# EasyEDA Pro project DRV电机驱动板_2024-10-17.epro

# Schematic DRV电机驱动
Create Date: 2023-05-12; Page Name: P1; Project Name: DRV电机驱动（最终版）; Schematic Name: DRV电机驱动; Update Date: 2023-05-27; Company: 嘉立创EDA; Page Size: A4; Version: V1.0
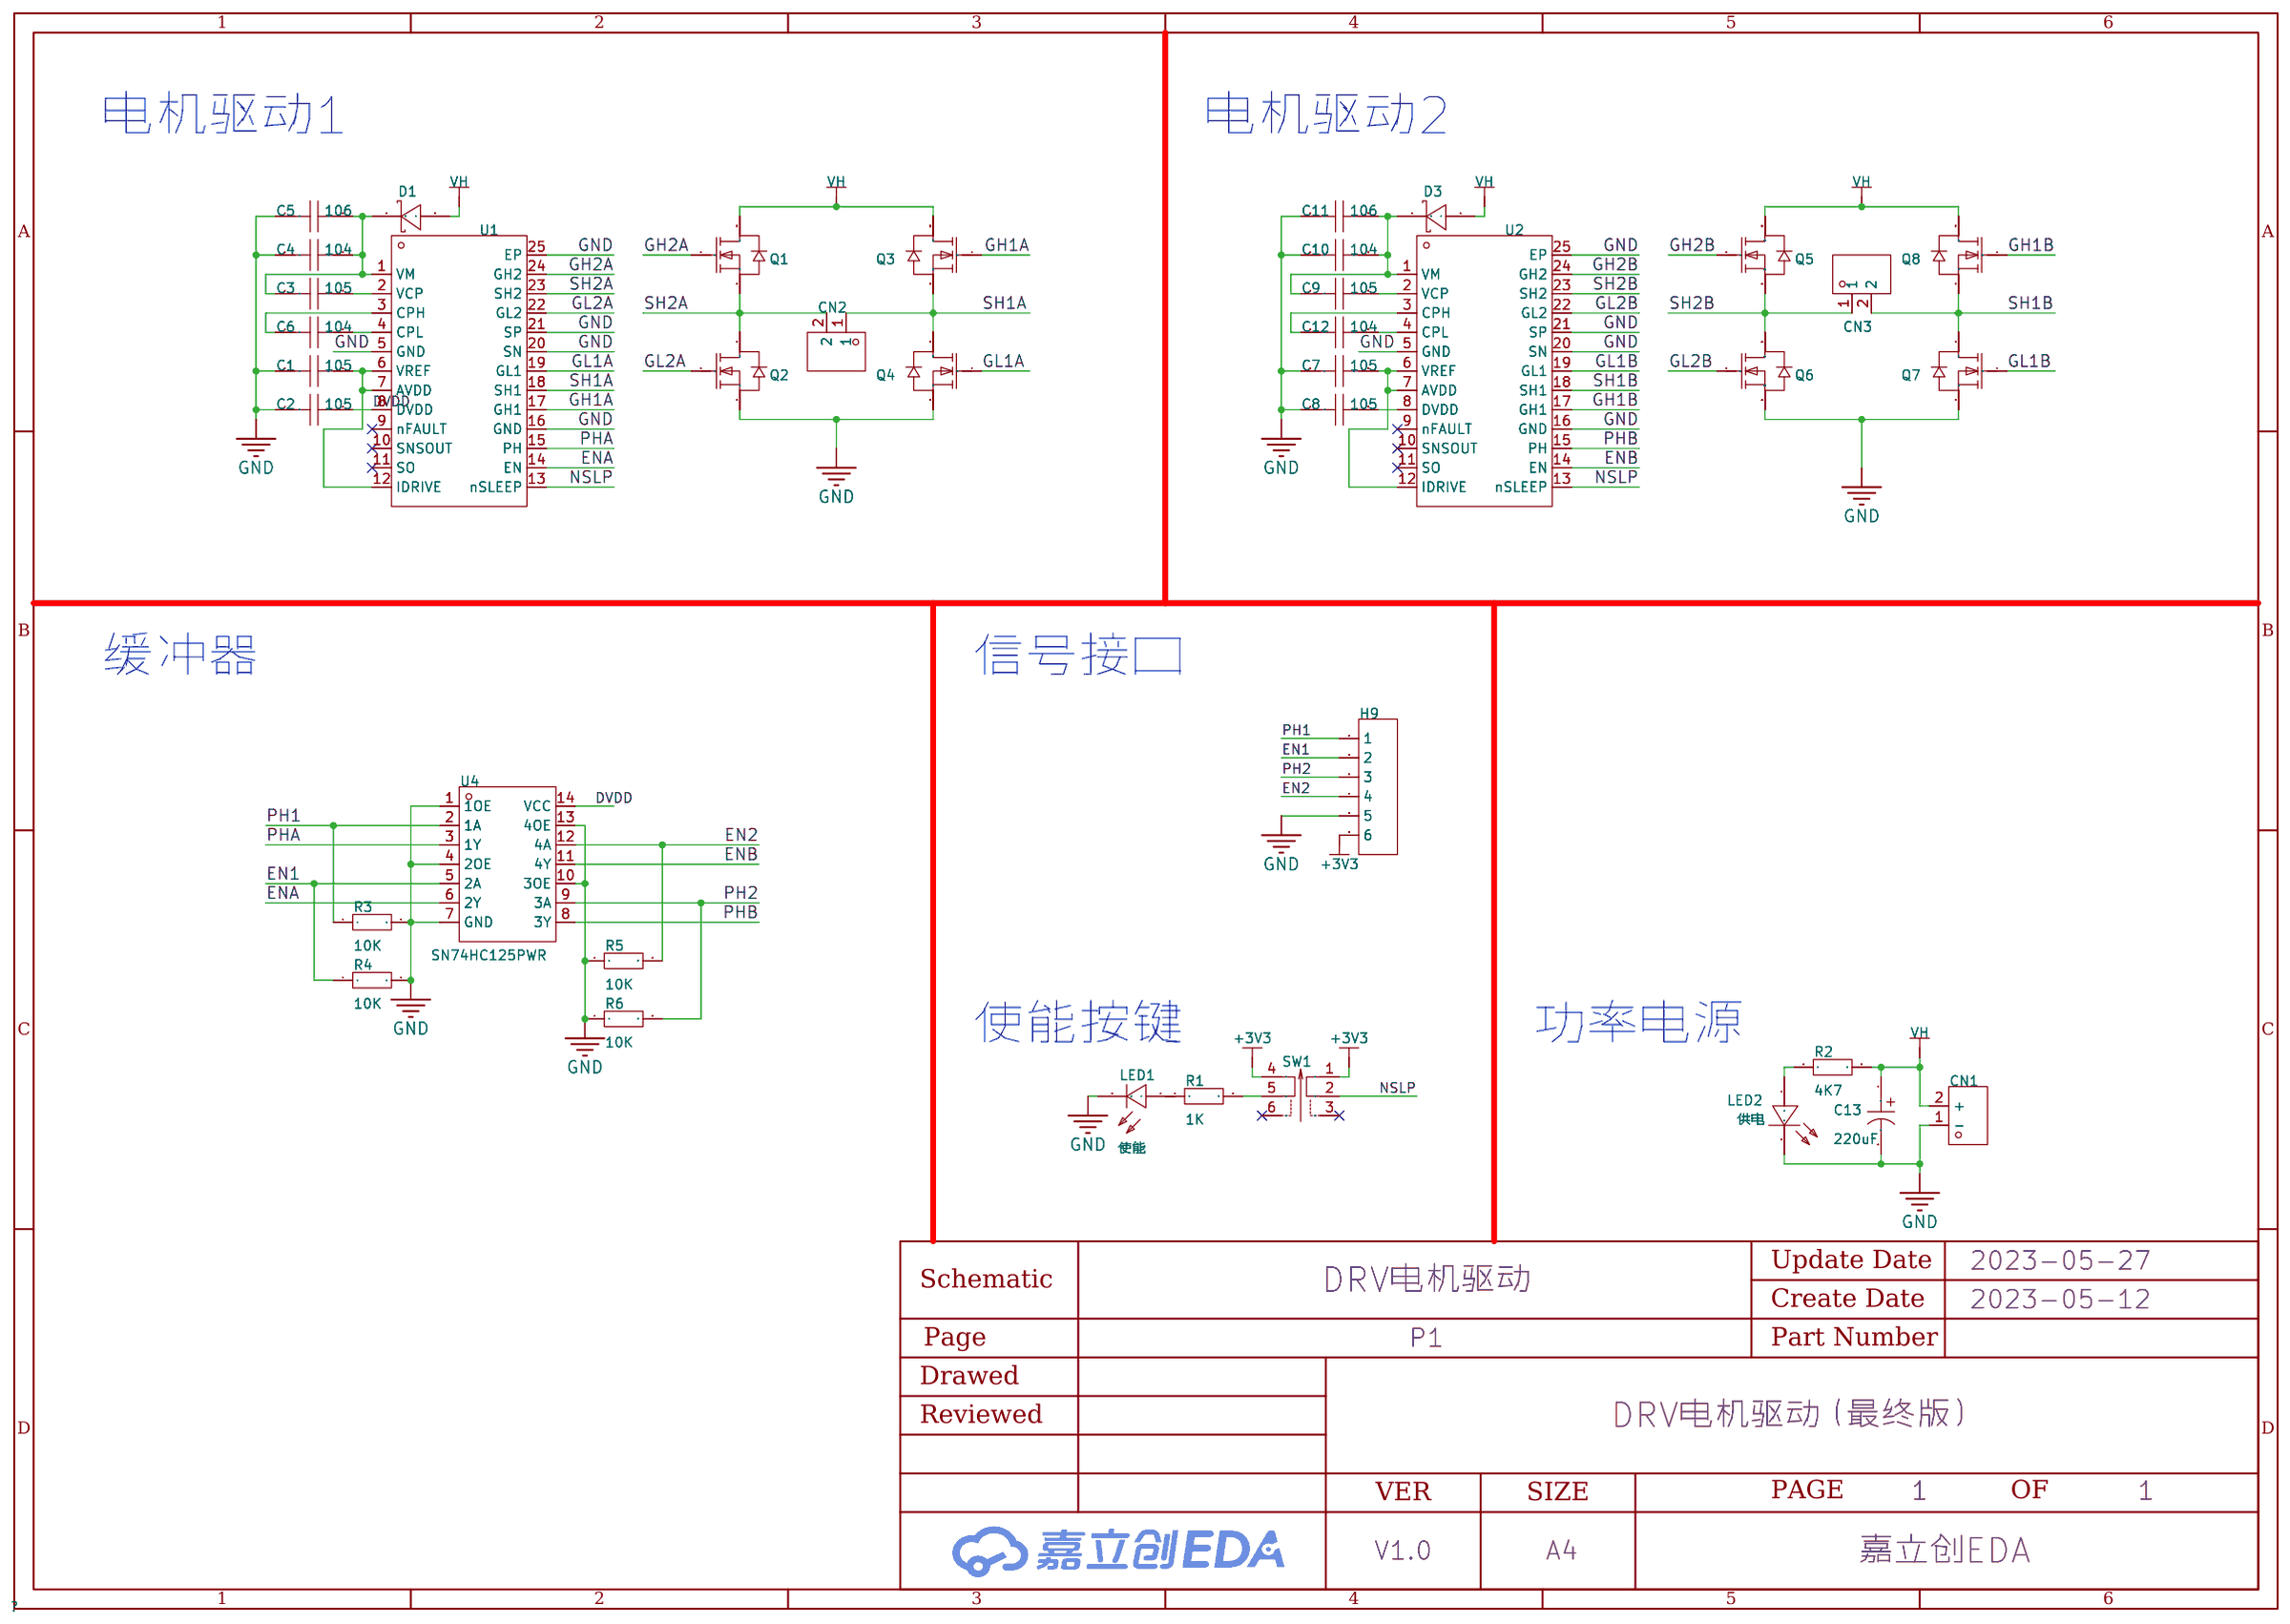
[diagram p0: schematic sheet]

## Parts
C1  105  [C0603]
C2  105  [C0603]
C3  105  [C0603]
C4  104  [C0603]
C5  106  [C0603]
C6  104  [C0603]
C7  105  [C0603]
C8  105  [C0603]
C9  105  [C0603]
C10  104  [C0603]
C11  106  [C0603]
C12  104  [C0603]
C13  220uF  [CAP-TH_BD8.0-P3.50-D0.6-FD]
CN1  -  [CONN-TH_XT30UPB-M]
CN2  KF301-5.0-2P  [CONN-TH_P5.00_KF301-5.0-2P]
CN3  KF301-5.0-2P  [CONN-TH_P5.00_KF301-5.0-2P]
D1  1N5819WS  [SOD-323_L1.8-W1.3-LS2.5-RD]
D3  1N5819WS  [SOD-323_L1.8-W1.3-LS2.5-RD]
H9  -  [HDR-TH_6P-P2.54-V-M-1]
LED1  使能  [LED0603-R-RD]
LED2  供电  [LED0603-R-RD]
Q1  CSD17570Q5B  [PG-TSON-8_L5.0-W6.0-P1.27-BL-EP_BSC021N08NS5]
Q2  CSD17570Q5B  [PG-TSON-8_L5.0-W6.0-P1.27-BL-EP_BSC021N08NS5]
Q3  CSD17570Q5B  [PG-TSON-8_L5.0-W6.0-P1.27-BL-EP_BSC021N08NS5]
Q4  CSD17570Q5B  [PG-TSON-8_L5.0-W6.0-P1.27-BL-EP_BSC021N08NS5]
Q5  CSD17570Q5B  [PG-TSON-8_L5.0-W6.0-P1.27-BL-EP_BSC021N08NS5]
Q6  CSD17570Q5B  [PG-TSON-8_L5.0-W6.0-P1.27-BL-EP_BSC021N08NS5]
Q7  CSD17570Q5B  [PG-TSON-8_L5.0-W6.0-P1.27-BL-EP_BSC021N08NS5]
Q8  CSD17570Q5B  [PG-TSON-8_L5.0-W6.0-P1.27-BL-EP_BSC021N08NS5]
R1  1K  [R0603]
R2  4K7  [R0603]
R3  10K  [R0603]
R4  10K  [R0603]
R5  10K  [R0603]
R6  10K  [R0603]
SW1  使能开关  [SW-TH_6P-L5.8-W5.8-P2.00-LS4.5-BL]
U1  DRV8701ERGER  [VQFN-24_L4.0-W4.0-P0.50-BL-EP2.8]
U2  DRV8701ERGER  [VQFN-24_L4.0-W4.0-P0.50-BL-EP2.8]
U4  SN74HC125PWR  [TSSOP-14_L5.0-W4.4-P0.65-LS6.4-TL]

## Library data of the parts
C1-C12 = CAP_0603: 容值:100nF;精度:±10%;额定电压:50V;温度系数:X7R;; Supplier Footprint: 0603
C13 = 250ARHA221M08A2: 类型:-;容值:220uF;精度:±20%;额定电压:25V;电容体直径:-;电容体长度:-;脚间距:-;纹波电流:-;等效串联电阻:-;工作寿命:-;工作温度:-;; LCSC Part Name: 220uF ±20% 25V; Supplier Part: C2681188; Manufacturer: APAQ(钰邦); Supplier Footprint: Radial,8x11.5mm; JLCPCB Part Class: 扩展库; Datasheet: https://atta.szlcsc.com/upload/public/pdf/source/20180420/C176310_E0097FD36002676809AE81630543C9E8.pdf; Supplier: LCSC; Tolerance: ±20%; Rated Voltage: 25V
CN1 = XT30UPB-M: Supplier Part: C428721; Manufacturer: AMASS(艾迈斯); JLCPCB Part Class: 扩展库; Datasheet: https://atta.szlcsc.com/upload/public/pdf/source/20190916/C428721_B0ECB8C5937139CEFE8736D2D3175B0E.pdf; Supplier: LCSC
CN2 CN3 = KF301-5.0-2P: 间距:5mm;排数:1;每排PIN数:2;安装方式:直针;额定电流:17A;额定电压:250V;线规 - AWG:14~22;线规 - mm?:1.5;工作温度范围:-30~+120;颜色:蓝色;; LCSC Part Name: 5mm 排数:1 每排P数:2 直针 可拼接 铜 环保; Supplier Part: C474881; Manufacturer: KEFA(科发); Supplier Footprint: P=5mm; JLCPCB Part Class: 扩展库; Datasheet: https://atta.szlcsc.com/upload/public/pdf/source/20200115/C474881_883EFE2003339C40FD1BEEEFC9A18423.pdf; Supplier: LCSC; Pitch: 5mm; Number of Rows: 1; Number of PINs Per Row: 2; Mounting Style: 直针; Current Rating (Max): 17A; Voltage Rating (Max): 250V; Wire Gauge - AWG: 14~22; Wire Gauge - mm?: 1.5; Operating Temperature Range: -30~+120; Color: 蓝色
D1 D3 = 1N5819WS_C440261: 直流反向耐压(Vr):40V;平均整流电流(Io):1A;正向压降(Vf):900mV@3A;; LCSC Part Name: 40V 1A 900mV@3A; Supplier Part: C440261; Manufacturer: PJSEMI(平晶微); Supplier Footprint: SOD-323; JLCPCB Part Class: 扩展库; Datasheet: https://atta.szlcsc.com/upload/public/pdf/source/20210224/C440261_8032C480D816C9C5CCE6FA0D0539A89A.pdf; Supplier: LCSC; Reverse Voltage (Vr): 40V; Average Rectified Current (Io): 1A; Forward Voltage (Vf@If): 900mV@3A
H9 = HDR-M_2.54_1x6P: Supplier Part: C37208; Supplier Footprint: 插件
LED1 = 19-217/G7C-AN1P2/3T: 照明颜色:普绿/黄绿;色温 - CCT（K）:-;主波长/色坐标:569.5~577.5nm;; LCSC Part Name: 0603 普绿/黄绿; Supplier Part: C72042; Manufacturer: EVERLIGHT(台湾亿光); Supplier Footprint: 0603; JLCPCB Part Class: 扩展库; Datasheet: https://atta.szlcsc.com/upload/public/pdf/source/20160507/1462613613739.pdf; Supplier: LCSC; Mounting Type: 表面贴装; Illumination Color: 普绿/黄绿; Luminous Intensity (IF=20mA): 28.5~72mcd; Dominant Wavelength / Coordinate rank: 569.5~577.5nm
LED2 = TLMS1000-GS08: 发光颜色:红灯;; LCSC Part Name: 红色 0603; Supplier Part: C241893; Manufacturer: VISHAY(威世); Supplier Footprint: 0603; JLCPCB Part Class: 扩展库; Datasheet: https://atta.szlcsc.com/upload/public/pdf/source/20180719/C241893_4BC7C846B3C52AB2D39E337E84999DF0.pdf; Supplier: LCSC; Emitted Color: 红灯
Q1-Q8 = CSD17570Q5B: 类型:-;漏源电压(Vdss):-;连续漏极电流(Id):-;功率(Pd):-;导通电阻(RDS(on)@Vgs,Id):-;阈值电压(Vgs(th)@Id):-;栅极电荷(Qg@Vgs):-;输入电容(Ciss@Vds):-;反向传输电容(Crss@Vds):-;; Supplier Part: C529279; Manufacturer: TI(德州仪器); Supplier Footprint: SON-8; JLCPCB Part Class: 扩展库; Datasheet: https://atta.szlcsc.com/upload/public/pdf/source/20200515/C529279_3264872A3F90DE278B9C19CF73F09D82.pdf; Supplier: LCSC
R1-R6 = Res_0603: Supplier Footprint: 0603
SW1 = PB22E60L: 触点电流:500mA;额定电压 (AC):-;额定电压 (DC):50V;绝缘电阻:100MΩ;电路结构:双刀双掷;安装方式:直插;自锁/无锁:-;按键形状:方形柱塞;按键/盖帽颜色:白色;带灯:-;引脚样式:PC引脚;作用力:180gf@±50gf;防护等级:-;工作温度:-40~+85;机械寿命:30000;; LCSC Part Name: 自锁开关; Supplier Part: C2987421; Manufacturer: CIKI(皓富); Supplier Footprint: 插件; JLCPCB Part Class: 扩展库; Datasheet: https://atta.szlcsc.com/upload/public/pdf/source/20220408/7804C2A84B830DBCF70465BF0AEFEFAC.pdf; Supplier: LCSC; Contact Current: 500mA; Voltage Rating (DC): 50V; Insulation Resistance: 100MΩ; Circuit: 双刀双掷; Mounting Style: 直插; Actuator Style: 方形柱塞; Actuator/Cap Color: 白色; Pin Style: PC引脚; Operating Force: 180gf@±50gf; Operating Temperature: -40~+85; Mechanical Life: 30000
U1 U2 = DRV8701ERGER: DRV8701 DRV8701 H 桥栅极驱动器; Supplier Part: C90964; Manufacturer: TI(德州仪器); Supplier Footprint: VQFN-24; JLCPCB Part Class: 扩展库; Datasheet: https://atta.szlcsc.com/upload/public/pdf/source/20190902/C90964_2DCC43C1A4AE58E3ED96296E8C78517C.pdf; Supplier: LCSC
U4 = SN74HC125PWRG4: 类型:缓冲器，非反相;电源电压:2V~6V;输入类型:-;输出类型:三态;低电平输出电流(IOL):7.8mA;高电平输出电流(IOH):7.8mA;工作温度:-40℃~+85℃;; Supplier Part: C2676184; Manufacturer: TI(德州仪器); Supplier Footprint: TSSOP-14; JLCPCB Part Class: Extended Part; Supplier: LCSC; Type: 缓冲器，非反相; Supply Voltage: 2V~6V; output type: 三态; Current-OutputLow: 7.8mA; Current-OutputHigh: 7.8mA; Operating temperature: -40℃~+85℃

## Nets
+3V3: H9.6 SW1.1 SW1.4
DVDD: C2.2 U1.8(DVDD) U4.14(VCC)
GND: C1.1 C2.1 C4.1 C5.1 C7.1 C8.1 C10.1 C11.1 C13.2 CN1.1(-) H9.5 LED1.2(C) LED2.2(K) Q2.1(S) Q2.2(S) Q2.3(S) Q4.1(S) Q4.2(S) Q4.3(S) Q6.1(S) Q6.2(S) Q6.3(S) Q7.1(S) Q7.2(S) Q7.3(S) R3.2 R4.2 R5.1 R6.1 U1.5(GND) U1.16(GND) U1.20(SN) U1.21(SP) U1.25(EP) U2.5(GND) U2.16(GND) U2.20(SN) U2.21(SP) U2.25(EP) U4.1(1OE) U4.4(2OE) U4.7(GND) U4.10(3OE) U4.13(4OE)
EN1: H9.2 R4.1 U4.5(2A)
EN2: H9.4 R5.2 U4.12(4A)
ENA: U1.14(EN) U4.6(2Y)
ENB: U2.14(EN) U4.11(4Y)
GH1A: Q3.4(G) U1.17(GH1)
GH1B: Q8.4(G) U2.17(GH1)
GH2A: Q1.4(G) U1.24(GH2)
GH2B: Q5.4(G) U2.24(GH2)
GL1A: Q4.4(G) U1.19(GL1)
GL1B: Q7.4(G) U2.19(GL1)
GL2A: Q2.4(G) U1.22(GL2)
GL2B: Q6.4(G) U2.22(GL2)
NSLP: SW1.2 U1.13(nSLEEP) U2.13(nSLEEP)
PH1: H9.1 R3.1 U4.2(1A)
PH2: H9.3 R6.2 U4.9(3A)
PHA: U1.15(PH) U4.3(1Y)
PHB: U2.15(PH) U4.8(3Y)
SH1A: CN2.1 Q3.1(S) Q3.2(S) Q3.3(S) Q4.5(D) Q4.6(D) Q4.7(D) Q4.8(D) U1.18(SH1)
SH1B: CN3.2 Q7.5(D) Q7.6(D) Q7.7(D) Q7.8(D) Q8.1(S) Q8.2(S) Q8.3(S) U2.18(SH1)
SH2A: CN2.2 Q1.1(S) Q1.2(S) Q1.3(S) Q2.5(D) Q2.6(D) Q2.7(D) Q2.8(D) U1.23(SH2)
SH2B: CN3.1 Q5.1(S) Q5.2(S) Q5.3(S) Q6.5(D) Q6.6(D) Q6.7(D) Q6.8(D) U2.23(SH2)
VH: C13.1 CN1.2(+) D1.2(A) D3.2(A) Q1.5(D) Q1.6(D) Q1.7(D) Q1.8(D) Q3.5(D) Q3.6(D) Q3.7(D) Q3.8(D) Q5.5(D) Q5.6(D) Q5.7(D) Q5.8(D) Q8.5(D) Q8.6(D) Q8.7(D) Q8.8(D) R2.2
$C1_2: C1.2 U1.6(VREF) U1.7(AVDD) U1.12(IDRIVE)
$C3_1: C3.1 C4.2 C5.2 D1.1(C) U1.1(VM)
$C3_2: C3.2 U1.2(VCP)
$C6_1: C6.1 U1.3(CPH)
$C6_2: C6.2 U1.4(CPL)
$C7_2: C7.2 U2.6(VREF) U2.7(AVDD) U2.12(IDRIVE)
$C8_2: C8.2 U2.8(DVDD)
$C9_1: C9.1 C10.2 C11.2 D3.1(C) U2.1(VM)
$C9_2: C9.2 U2.2(VCP)
$C12_1: C12.1 U2.3(CPH)
$C12_2: C12.2 U2.4(CPL)
$LED1_1: LED1.1(A) R1.1
$LED2_1: LED2.1(A) R2.1
$R1_2: R1.2 SW1.5

Not connected (* = marked no-connect by the designer): SW1 3* 6*; U1 9(nFAULT)* 10(SNSOUT)* 11(SO)*; U2 9(nFAULT)* 10(SNSOUT)* 11(SO)*

## Notes on the sheet
- 电机驱动1
- 电机驱动2
- 缓冲器
- 信号接口
- 使能按键
- 功率电源

# Board PCB2
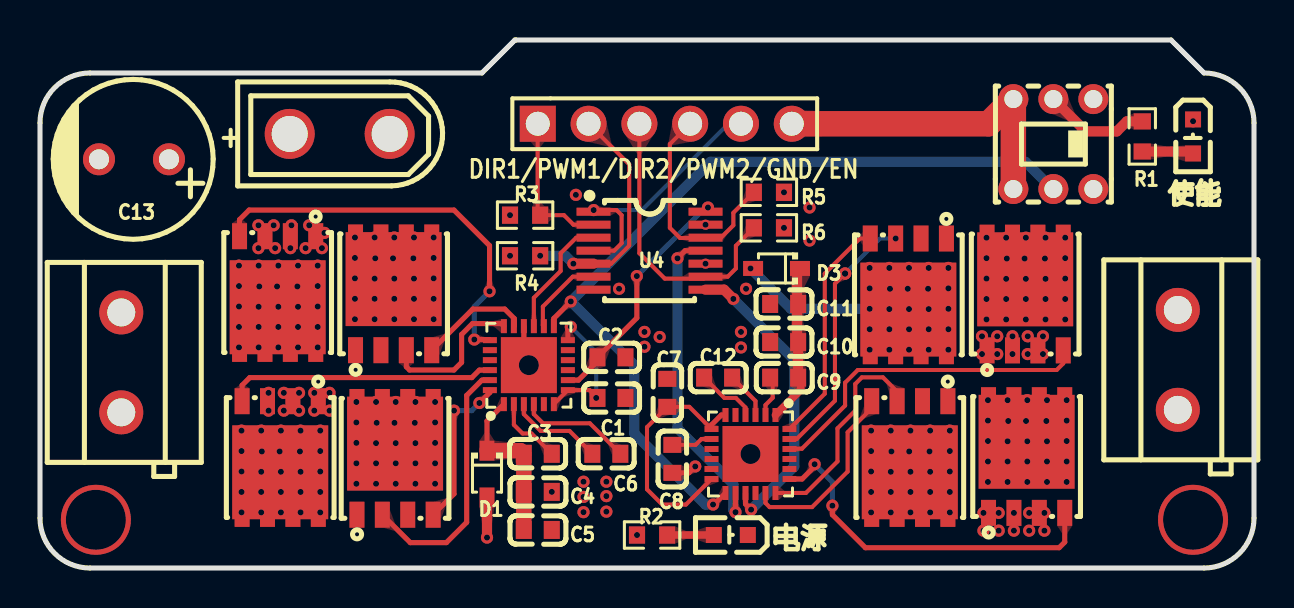
[diagram p1: board, top side]
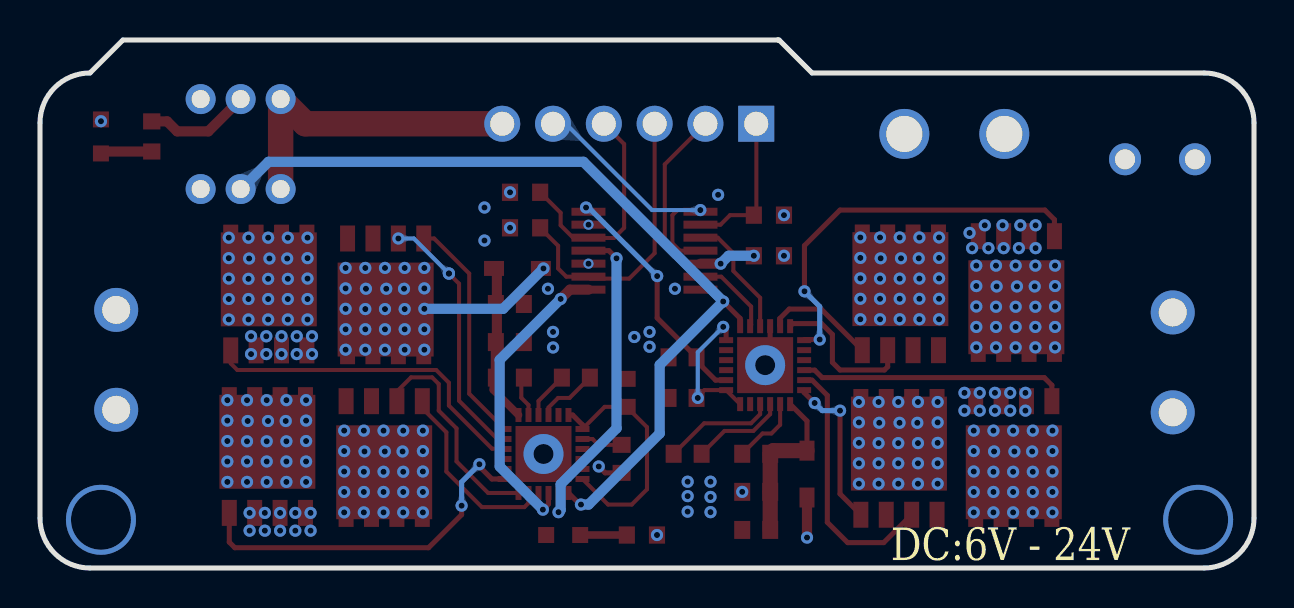
[diagram p2: board, bottom side, seen from below]

Outline 60.71 x 26.42 mm; copper layers: Top Layer, Bottom Layer. Coordinates in mm from the lower left corner of the outline.
Outline path: 0,22.27 0,2.5 arc(0.73,0.73) 2.5,0 58.21,0 arc(59.97,0.73) 60.71,2.5 60.71,22.27 arc(59.97,24.03) 58.21,24.77 56.55,26.42 23.75,26.42 22.1,24.77 2.5,24.77 arc(0.73,24.03) 0,22.27
Stack: Top Layer 0.035mm / Dielectric1 1.51mm FR4 er 4.5 / Bottom Layer 0.035mm

## Design rules (mm)
spacing copperThickness1oz (default): track to track 0.102, other pairs 0.152 to 0.3
spacing copperThickness2oz: track to track 0.203, other pairs 0.152 to 0.3
track width copperThickness1oz (default): min 0.127, default 0.254, max 2.54
track width copperThickness2oz: min 0.203, default 0.254, max 2.54
differential pair differentialPair (default): width min 0.127, default 0.254, max 2.54; gap min 0.152, default 0.152
via viaSize (default): diameter min 0.5, default 0.61, max 10; hole min 0.3, default 0.305, max 6.3

## Placement (name value [footprint] x y rotation side)
C1  105  [C0603]  28.58 8.51 180 top
C2  105  [C0603]  28.58 10.54 180 top
C3  105  [C0603]  24.89 5.72 0 top
C4  104  [C0603]  24.89 3.81 180 top
C5  106  [C0603]  24.89 1.91 180 top
C6  104  [C0603]  28.32 5.72 0 top
C7  105  [C0603]  31.37 8.76 270 top
C8  105  [C0603]  31.62 5.46 90 top
C9  105  [C0603]  37.21 9.53 180 top
C10  104  [C0603]  37.21 11.3 0 top
C11  106  [C0603]  37.21 13.21 0 top
C12  104  [C0603]  33.91 9.53 180 top
C13  220uF  [CAP-TH_BD8.0-P3.50-D0.6-FD]  4.7 20.45 180 top
CN1  -  [CONN-TH_XT30UPB-M]  14.99 21.72 180 top
CN2  KF301-5.0-2P  [CONN-TH_P5.00_KF301-5.0-2P]  4.06 10.29 270 top
CN3  KF301-5.0-2P  [CONN-TH_P5.00_KF301-5.0-2P]  56.9 10.41 270 top
D1  1N5819WS  [SOD-323_L1.8-W1.3-LS2.5-RD]  22.35 4.7 270 top
D3  1N5819WS  [SOD-323_L1.8-W1.3-LS2.5-RD]  36.83 14.99 180 top
H9  -  [HDR-TH_6P-P2.54-V-M-1]  31.24 22.22 0 top
LED1  使能  [LED0603-R-RD]  57.66 21.59 270 top
LED2  供电  [LED0603-R-RD]  34.54 1.65 180 top
Q1  CSD17570Q5B  [PG-TSON-8_L5.0-W6.0-P1.27-BL-EP_BSC021N08NS5]  17.75 5.49 0 top
Q2  CSD17570Q5B  [PG-TSON-8_L5.0-W6.0-P1.27-BL-EP_BSC021N08NS5]  12.01 5.53 180 top
Q3  CSD17570Q5B  [PG-TSON-8_L5.0-W6.0-P1.27-BL-EP_BSC021N08NS5]  17.68 13.72 0 top
Q4  CSD17570Q5B  [PG-TSON-8_L5.0-W6.0-P1.27-BL-EP_BSC021N08NS5]  11.88 13.78 180 top
Q5  CSD17570Q5B  [PG-TSON-8_L5.0-W6.0-P1.27-BL-EP_BSC021N08NS5]  43.42 13.67 180 top
Q6  CSD17570Q5B  [PG-TSON-8_L5.0-W6.0-P1.27-BL-EP_BSC021N08NS5]  49.26 13.71 0 top
Q7  CSD17570Q5B  [PG-TSON-8_L5.0-W6.0-P1.27-BL-EP_BSC021N08NS5]  49.34 5.58 0 top
Q8  CSD17570Q5B  [PG-TSON-8_L5.0-W6.0-P1.27-BL-EP_BSC021N08NS5]  43.49 5.53 180 top
R1  1K  [R0603]  55.12 21.59 90 top
R2  4K7  [R0603]  30.61 1.65 180 top
R3  10K  [R0603]  24.26 17.65 180 top
R4  10K  [R0603]  24.26 15.62 180 top
R5  10K  [R0603]  36.45 18.8 180 top
R6  10K  [R0603]  36.45 17.02 180 top
SW1  使能开关  [SW-TH_6P-L5.8-W5.8-P2.00-LS4.5-BL]  50.67 21.21 0 top
U1  DRV8701ERGER  [VQFN-24_L4.0-W4.0-P0.50-BL-EP2.8]  24.45 10.15 0 top
U2  DRV8701ERGER  [VQFN-24_L4.0-W4.0-P0.50-BL-EP2.8]  35.53 5.7 180 top
U4  SN74HC125PWR  [TSSOP-14_L5.0-W4.4-P0.65-LS6.4-TL]  30.48 15.88 0 top

## Footprints (pads in the part's own frame, mm; a bottom-side part is the same pattern mirrored in y, then rotated)
C0603
  rect 0.8x0.9 smd: 1(-0.7,0) 2(0.7,0)
CAP-TH_BD8.0-P3.50-D0.6-FD
  round 1.6 hole 1: 1(-1.75,0) 2(1.75,0)
CONN-TH_P5.00_KF301-5.0-2P
  round 2.2 hole 1.399: 1(-2.499,0) 2(2.499,0)
CONN-TH_XT30UPB-M
  round 2.499 hole 1.801: 1(-2.499,0) 2(2.499,0)
HDR-TH_6P-P2.54-V-M-1
  rect 1.8x1.8 hole 1.2: 1(-6.35,0)
  round 1.8 hole 1.2: 2(-3.81,0) 3(-1.27,0) 4(1.27,0) 5(3.81,0) 6(6.35,0)
LED0603-R-RD
  rect 0.8x0.8 smd: 1(0.851,0) 2(-0.851,0)
PG-TSON-8_L5.0-W6.0-P1.27-BL-EP_BSC021N08NS5
  rect 0.75x1.3 smd: 1(-1.905,-2.82) 2(-0.635,-2.82) 3(0.635,-2.82) 4(1.905,-2.82) 5(1.905,2.82) 6(0.635,2.82) 7(-0.635,2.82) 8(-1.905,2.82)
  rect 4.801x4.699 smd: 8(0,0.737)
R0603
  rect 0.806x0.864 smd: 1(-0.753,0) 2(0.753,0)
SOD-323_L1.8-W1.3-LS2.5-RD
  rect 1x0.75 smd: 1(-1.173,0) 2(1.173,0)
SW-TH_6P-L5.8-W5.8-P2.00-LS4.5-BL
  round 1.5 hole 0.9: 1(-2,-2.25) 2(0,-2.25) 3(2,-2.25) 4(-2,2.25) 5(0,2.25) 6(2,2.25)
TSSOP-14_L5.0-W4.4-P0.65-LS6.4-TL
  rect 1.7x0.4 smd: 1(-2.8,1.95) 2(-2.8,1.3) 3(-2.8,0.65) 4(-2.8,0) 5(-2.8,-0.65) 6(-2.8,-1.3) 7(-2.8,-1.95) 8(2.8,-1.95) 9(2.8,-1.3) 10(2.8,-0.65) 11(2.8,0) 12(2.8,0.65) 13(2.8,1.3) 14(2.8,1.95)
VQFN-24_L4.0-W4.0-P0.50-BL-EP2.8
  rect 0.3x0.7 smd: 1(-1.25,-1.95) 2(-0.75,-1.95) 3(-0.25,-1.95) 4(0.25,-1.95) 5(0.75,-1.95) 6(1.25,-1.95) 13(1.25,1.95) 14(0.75,1.95) 15(0.25,1.95) 16(-0.25,1.95) 17(-0.75,1.95) 18(-1.25,1.95)
  rect 0.7x0.3 smd: 7(1.95,-1.25) 8(1.95,-0.75) 9(1.95,-0.25) 10(1.95,0.25) 11(1.95,0.75) 12(1.95,1.25) 19(-1.95,1.25) 20(-1.95,0.75) 21(-1.95,0.25) 22(-1.95,-0.25) 23(-1.95,-0.75) 24(-1.95,-1.25)
  rect 2.8x2.8 smd: 25(0,0)

## Nets
As in the schematic.

Pads without a net: SW1 3 6; U1 9 10 11; U2 9 10 11

## Via types
v1: diameter 0.61, hole 0.305, Top Layer to Bottom Layer, 288 vias
v2: diameter 3.5, hole 3, Top Layer to Bottom Layer, 2 vias
v3: diameter 0.508, hole 0.305, Top Layer to Bottom Layer, 2 vias
v4: diameter 2, hole 1, Top Layer to Bottom Layer, 2 vias

## Routing (per net, layer and track width the routed paths; a pad name or vN(x,y) marks a point on that pad's centre or on a via; arc(x,y) is an arc through that point)
+3V3: length 16.1
  Top Layer w1.27: SW1.1 SW1.4 47.44,22.22 H9.6
DVDD: length 11.9
  Top Layer w0.254: U1.8 26.93,9.4 27.88,10.35 C2.2 29.85,12.51 v1(29.85,14.61)
  Bottom Layer w0.254: v1(33.4,18.03) 33.27,18.03 v1(29.85,14.61)
GND: length 17.3
  Top Layer w0.203: U4.1 27.76,17.91 28.83,17.91 29.08,17.65 29.08,16.25 28.71,15.88 U4.4
  Top Layer w0.254: 24.2,10.4 v4(24.45,10.15) 24.2,10.4 ; 24.2,10.4 24.2,12.1 ; C8.1 32.45,4.76 v1(32.77,5.08)
  Bottom Layer w0.203: v1(27.69,17.91) 30.1,17.91 34.42,22.22 H9.5
  vias: v1(10.92,17.14) v1(10.92,16) v1(11.43,8.76) v1(11.43,7.87) v1(11.68,17.14) v1(11.76,16) v1(12.19,8.76) v1(12.19,7.87) v1(12.57,17.14) v1(12.52,16) v1(12.95,8.76) v1(12.95,7.87) v1(13.28,16) v1(13.46,17.14) v1(13.72,8.76) v1(13.72,7.87) v1(14.1,16) v1(14.22,16.76) v1(14.48,8.76) v1(14.48,7.87) v1(23.5,17.65) v1(23.5,15.62) v1(25.59,3.81) v1(26.8,18.67) v1(27.18,4.32) v1(27.18,3.56) v1(27.18,2.79) v1(28.32,4.32) v1(28.32,3.6) v1(28.32,2.82) v1(28.96,13.97) v1(30.23,11.81) v1(30.23,11.07) v1(30.99,11.56) v1(35.05,11.81) v1(35.05,11.03) v1(35.31,13.97) v1(37.2,18.8) v1(37.2,17.02) v1(38.48,18.03) v1(38.48,16.38) v1(47.1,11.59) v1(47.1,10.7) v1(47.18,2.76) v1(47.18,1.87) v1(47.87,11.59) v1(47.87,10.7) v1(47.94,2.76) v1(47.94,1.87) v1(48.63,11.59) v1(48.63,10.7) v1(48.7,2.76) v1(48.7,1.87) v1(49.39,11.59) v1(49.39,10.7) v1(49.46,2.76) v1(49.46,1.87) v1(50.15,11.59) v1(50.15,10.7) v1(50.23,2.76) v1(50.23,1.87) v1(57.66,22.35) v2(2.79,2.41) v2(57.66,2.41) v3(33.28,17.17) v3(33.28,15.22) v4(35.53,5.7)
$C1_2: length 7.4
  Top Layer w0.203: C1.2 27.48,8.9 U1.7 U1.6
  Top Layer w0.254: v1(26.54,12.06) 26.4,11.92 U1.12
  Bottom Layer w0.203: v1(27.81,8.51) 27.81,10.8 v1(26.54,12.06)
$C3_1: length 8.4
  Top Layer w0.254: D1.1 22.35,7.36 23.2,8.2
  Top Layer w0.762: D1.1 24.04,5.87 C3.1 C4.2 C5.2
$C3_2: length 3.5
  Top Layer w0.203: C3.2 24.58,6.73 24.13,6.73 23.7,7.17 23.7,8.2
$C6_1: length 4.7
  Top Layer w0.203: 24.2,8.2 24.2,7.7 25.03,6.86 26.48,6.86 C6.1
$C6_2: length 5.6
  Top Layer w0.203: 24.7,8.2 24.7,7.7 25.15,7.24 27.5,7.24 C6.2
$C7_2: length 12.4
  Top Layer w0.203: U2.7 32.47,8.06 C7.2 30.35,7.05 30.35,3.94 31.11,3.17 32.3,3.17 U2.12
  Top Layer w0.254: U2.6 34.07,7.65 33.58,7.16 U2.7
$C8_2: length 2.3
  Top Layer w0.203: U2.8 33.08,6.45 32.78,6.16 31.37,6.16
$C9_1: length 7.7
  Top Layer w0.381: U2.1 38.04,8.91 38.04,9.4 C9.1
  Top Layer w0.508: C9.1 C10.2 37.86,11.35 37.86,14.76
$C9_2: length 1.9
  Top Layer w0.203: U2.2 36.28,8.16 36.64,8.52 36.64,9.4
$C12_1: length 2.4
  Top Layer w0.203: U2.3 35.78,8.36 C12.1
$C12_2: length 3.1
  Top Layer w0.203: U2.4 35.28,8.03 34.8,8.51 34.23,8.51 C12.2
$LED1_1: length 2.6
  Top Layer w0.508: LED1.1 57.56,20.84 R1.1
$LED2_1: length 2.3
  Top Layer w0.381: R2.1 LED2.1
$R1_2: length 5.3
  Top Layer w0.508: R1.2 54.35,22.34 53.85,21.84 52.29,21.84 SW1.5
EN1: length 11.9
  Top Layer w0.203: U4.5 28.56,15.22 29.46,16.13 29.46,20.19 H9.2
  Top Layer w0.508: U4.5 v1(26.67,15.22)
  Bottom Layer w0.508: v1(26.67,15.22) 26.27,15.62 v1(25.01,15.62)
EN2: length 11.4
  Top Layer w0.203: R5.2 34.67,17.77 34.67,17.14 34.05,16.53 U4.12 33.27,16.51 32,16.51 31.5,17.02 31.5,21.21 H9.4
ENA: length 4.2
  Top Layer w0.203: U4.6 26.64,14.58 25.15,13.08 25.15,12.15 25.2,12.1
ENB: length 16.4
  Top Layer w0.254: v1(31.88,15.49) 32.26,15.88 U4.11 ; 34.78,3.75 v1(34.78,2.79)
  Bottom Layer w0.508: v1(34.78,2.79) 34.67,2.9 34.67,4.19 31.88,6.98 v1(31.88,15.49)
GH1A: length 5.6
  Top Layer w0.254: 23.7,12.1 23.72,12.12 23.72,12.48 23.24,12.95 21.64,12.95 Q3.4
GH1B: length 9.4
  Top Layer w0.203: 36.28,3.75 36.28,3.25 36.48,3.05 38.61,3.05 40.39,4.83 40.39,6.79 41.59,7.99 Q8.4
GH2A: length 7.9
  Top Layer w0.254: v1(20.7,7.87) 20.7,3.71 Q1.4 ; 22.5,8.9 22.5,8.78 v1(21.97,8.25)
  Bottom Layer w0.254: v1(20.7,7.87) 21.59,7.87 v1(21.97,8.25)
GH2B: length 11.5
  Top Layer w0.203: U2.24 39.24,8.72 39.24,14.73 41,16.48 Q5.4
GL1A: length 20.1
  Top Layer w0.254: 22.5,11.4 22.47,11.43 v1(21.72,11.43) ; v1(22.48,13.84) 22.48,16.13 20.7,17.91 10.46,17.91 9.98,17.43 Q4.4
  Bottom Layer w0.254: v1(21.72,11.43) 21.72,13.08 v1(22.48,13.84)
GL1B: length 18.5
  Top Layer w0.254: Q7.4 51.24,1.3 50.96,1.02 41.28,1.02 39.62,2.67 39.62,3.3 ; 38.73,5.08 38.11,4.45 U2.19
  Bottom Layer w0.254: v1(38.73,5.19) 39.62,4.3 v1(39.62,3.12)
GL2A: length 13.5
  Top Layer w0.254: 22.5,9.9 21.97,9.9 21.59,9.53 10.49,9.53 10.11,9.14 Q2.4
GL2B: length 16.8
  Top Layer w0.203: U2.22 37.49,5.97 38.1,5.97 40.26,8.13 40.26,9.27 40.89,9.91 50.84,9.91 51.17,10.24 Q6.4
NSLP: length 43.3
  Top Layer w0.254: 34.28,3.75 33.7,3.17 v1(33.66,3.17) ; v1(26.54,13.33) 25.7,12.49 25.7,12.1
  Bottom Layer w0.508: v1(33.66,3.17) 33.27,3.17 29.72,6.73 29.72,10.16 v1(26.54,13.33) 33.53,20.32 49.28,20.32 50.64,18.96
PH1: length 7.5
  Top Layer w0.203: H9.1 24.88,22.22 24.88,17.78 R3.1 26.2,17.65 26.68,17.17 U4.2
PH2: length 14.4
  Top Layer w0.203: R6.2 34.8,16.12 34.8,14.99 34.39,14.58 U4.9 33.18,14.48 31.24,14.48 29.97,15.75 H9.3
PHA: length 6.2
  Top Layer w0.203: U4.3 26.81,16.53 26.04,15.75 26.04,14.86 24.7,13.52 24.7,12.1
PHB: length 15.1
  Top Layer w0.254: v1(35.56,2.92) 35.28,3.2 35.28,3.75
  Top Layer w0.508: 34.54,13.59 34.21,13.92 U4.8
  Bottom Layer w0.508: v1(35.56,2.92) 37.72,5.08 37.72,10.41 v1(34.67,13.46)
SH1A: length 7.6
  Top Layer w0.254: 23.2,12.1 23.07,12.23 21.62,12.23 21.08,11.68 21.08,10.29 20.7,9.91 18.48,9.91 18.32,10.07 Q3.3
  vias: v1(9.95,15.13) v1(9.95,14.11) v1(9.95,13.08) v1(9.95,12.06) v1(9.95,11.04) v1(10.93,15.13) v1(10.97,14.09) v1(10.93,13.07) v1(10.93,12.06) v1(10.93,11.04) v1(11.85,14.09) v1(11.92,15.13) v1(11.92,13.07) v1(11.92,12.06) v1(11.92,11.04) v1(12.9,15.13) v1(12.87,14.09) v1(12.9,13.07) v1(12.9,12.06) v1(12.9,11.04) v1(13.89,15.13) v1(13.89,14.11) v1(13.89,13.08) v1(13.89,12.06) v1(13.89,11.04)
SH1B: length 11
  Top Layer w0.203: Q8.3 42.86,8.83 42.15,9.54 41.1,9.54 40.77,9.21 40.77,7.87 39.88,6.98 39.88,5.33 38.3,3.75 36.78,3.75
  vias: v1(47.4,8.4) v1(47.4,7.37) v1(47.4,6.35) v1(47.4,5.33) v1(47.4,4.31) v1(48.39,8.4) v1(48.39,6.34) v1(48.39,5.33) v1(48.39,4.31) v1(48.42,7.36) v1(49.31,7.36) v1(49.37,8.4) v1(49.37,6.34) v1(49.37,5.33) v1(49.37,4.31) v1(50.35,8.4) v1(50.32,7.36) v1(50.35,6.34) v1(50.35,5.33) v1(50.35,4.31) v1(51.34,8.4) v1(51.34,7.37) v1(51.34,6.35) v1(51.34,5.33) v1(51.34,4.31)
SH2A: length 13
  Top Layer w0.254: 22.5,9.4 22.1,9.4 21.34,8.64 21.34,2.29 20.32,1.27 18.52,1.27 Q1.2
  vias: v1(10.08,6.87) v1(10.08,5.85) v1(10.08,4.83) v1(10.08,3.81) v1(10.08,2.78) v1(11.06,6.87) v1(11.09,5.83) v1(11.06,4.81) v1(11.06,3.81) v1(11.06,2.78) v1(11.98,5.83) v1(12.05,6.87) v1(12.05,4.81) v1(12.05,3.81) v1(12.05,2.78) v1(13,5.83) v1(13.03,6.87) v1(13.03,4.81) v1(13.03,3.81) v1(13.03,2.78) v1(14.01,6.87) v1(14.01,5.85) v1(14.01,4.83) v1(14.01,3.81) v1(14.01,2.78)
SH2B: length 12.9
  Top Layer w0.203: v1(40.26,14.73) 39.75,14.22 39.75,8.37 37.84,6.45 U2.23
  Bottom Layer w0.203: v1(40.26,14.73) 42.01,16.48 v1(42.79,16.48)
  vias: v1(47.33,16.53) v1(47.33,15.5) v1(47.33,14.48) v1(47.33,13.46) v1(47.33,12.44) v1(48.31,16.53) v1(48.31,14.47) v1(48.31,13.46) v1(48.31,12.44) v1(48.35,15.48) v1(49.3,16.53) v1(49.23,15.48) v1(49.3,14.47) v1(49.3,13.46) v1(49.3,12.44) v1(50.28,16.53) v1(50.25,15.48) v1(50.28,14.47) v1(50.28,13.46) v1(50.28,12.44) v1(51.27,16.53) v1(51.27,15.5) v1(51.27,14.48) v1(51.27,13.46) v1(51.27,12.44)
VH: length 8.8
  Top Layer w0.508: D1.2 v1(22.35,1.52)
  Bottom Layer w0.508: v1(41.49,12.97) 37.55,12.97 v1(35.53,14.99)
  vias: v1(15.75,16.54) v1(15.75,15.51) v1(15.75,14.49) v1(15.75,13.47) v1(15.75,12.45) v1(15.82,8.31) v1(15.82,7.28) v1(15.82,6.26) v1(15.82,5.24) v1(15.82,4.22) v1(16.73,16.54) v1(16.76,15.49) v1(16.73,14.48) v1(16.73,13.47) v1(16.73,12.45) v1(16.8,8.31) v1(16.8,6.25) v1(16.8,5.24) v1(16.8,4.22) v1(16.84,7.26) v1(17.65,15.49) v1(17.72,16.54) v1(17.72,14.48) v1(17.72,13.47) v1(17.72,12.45) v1(17.79,8.31) v1(17.73,7.26) v1(17.79,6.25) v1(17.79,5.24) v1(17.79,4.22) v1(18.7,16.54) v1(18.67,15.49) v1(18.7,14.48) v1(18.7,13.47) v1(18.7,12.45) v1(18.77,8.31) v1(18.74,7.26) v1(18.77,6.25) v1(18.77,5.24) v1(18.77,4.22) v1(19.69,16.54) v1(19.69,15.51) v1(19.69,14.49) v1(19.69,13.47) v1(19.69,12.45) v1(19.76,8.31) v1(19.76,7.28) v1(19.76,6.26) v1(19.76,5.24) v1(19.76,4.22) v1(29.85,1.65) v1(41.49,15.01) v1(41.49,13.99) v1(41.49,11.94) v1(41.49,10.92) v1(41.56,6.87) v1(41.56,5.85) v1(41.56,4.83) v1(41.56,3.81) v1(41.56,2.78) v1(42.47,15.01) v1(42.5,13.97) v1(42.47,12.95) v1(42.47,11.94) v1(42.47,10.92) v1(42.54,6.87) v1(42.58,5.83) v1(42.54,4.81) v1(42.54,3.81) v1(42.54,2.78) v1(43.39,13.97) v1(43.46,15.01) v1(43.46,12.95) v1(43.46,11.94) v1(43.46,10.92) v1(43.46,5.83) v1(43.53,6.87) v1(43.53,4.81) v1(43.53,3.81) v1(43.53,2.78) v1(44.41,13.97) v1(44.44,15.01) v1(44.44,12.95) v1(44.44,11.94) v1(44.44,10.92) v1(44.51,6.87) v1(44.48,5.83) v1(44.51,4.81) v1(44.51,3.81) v1(44.51,2.78) v1(45.42,15.01) v1(45.42,13.99) v1(45.42,12.97) v1(45.42,11.94) v1(45.42,10.92) v1(45.5,6.87) v1(45.5,5.85) v1(45.5,4.83) v1(45.5,3.81) v1(45.5,2.78)

## Copper pours and planes (outline as drawn; the poured copper is in the pictures)
GND on Top Layer: -4.83,28.58 64.52,28.58 64.52,-4.57 -4.83,-4.57
GND on Bottom Layer: -6.48,31.24 70.48,31.24 70.48,-10.03 -6.48,-10.03
SH1A on Top Layer: 2.55,15.49 14.73,15.49 14.73,11.76 18.92,11.76 18.92,10.16 2.55,10.16
SH1A on Bottom Layer: 2.67,15.49 14.22,15.49 14.22,10.97 2.67,10.97
SH1B on Top Layer: 42.29,7.49 46.36,7.49 46.36,3.79 58.67,3.79 58.67,9.2 42.29,9.2
SH1B on Bottom Layer: 46.74,9.14 58.67,9.14 58.67,3.46 46.64,3.46 46.64,9.05
SH2A on Top Layer: 2.48,9.36 8.45,9.36 8.45,8.24 9.32,7.37 14.83,7.37 14.83,3.5 18.92,3.5 18.92,1.46 2.48,1.46
SH2A on Bottom Layer: 2.61,9.02 8.26,9.02 8.26,8.25 9.4,7.11 14.35,7.11 14.35,1.78 2.61,1.78
SH2B on Top Layer: 42.29,17.4 56.94,17.4 58.84,15.5 58.84,11.37 52.61,11.37 51.96,12.02 46.44,12.02 46.44,15.34 46.11,15.67 42.29,15.67
SH2B on Bottom Layer: 46.74,12.06 51.96,12.06 52.59,11.43 58.88,11.43 58.88,17.4 46.74,17.4
VH on Bottom Layer: 5.21,23.24 13.85,23.24 13.85,22.34 17.53,18.67 20.19,18.67 20.19,3.81 21.72,2.29 40.51,2.29 40.73,2.5 40.73,13.99 41.91,15.17 41.91,15.37 46.11,15.37 46.11,0.25 15.27,0.25 15.27,16.48 12.95,18.8 5.21,18.8

Small or netless copper shapes (teardrops, artwork), in the pictures only: 114 on Top Layer, 16 on Bottom Layer

## Text on the board
Bottom Silkscreen Layer: DC:6V - 24V
Top Silkscreen Layer: DIR1/PWM1/DIR2/PWM2/GND/EN | + | 电源 | 使能

# Board DRV电机驱动
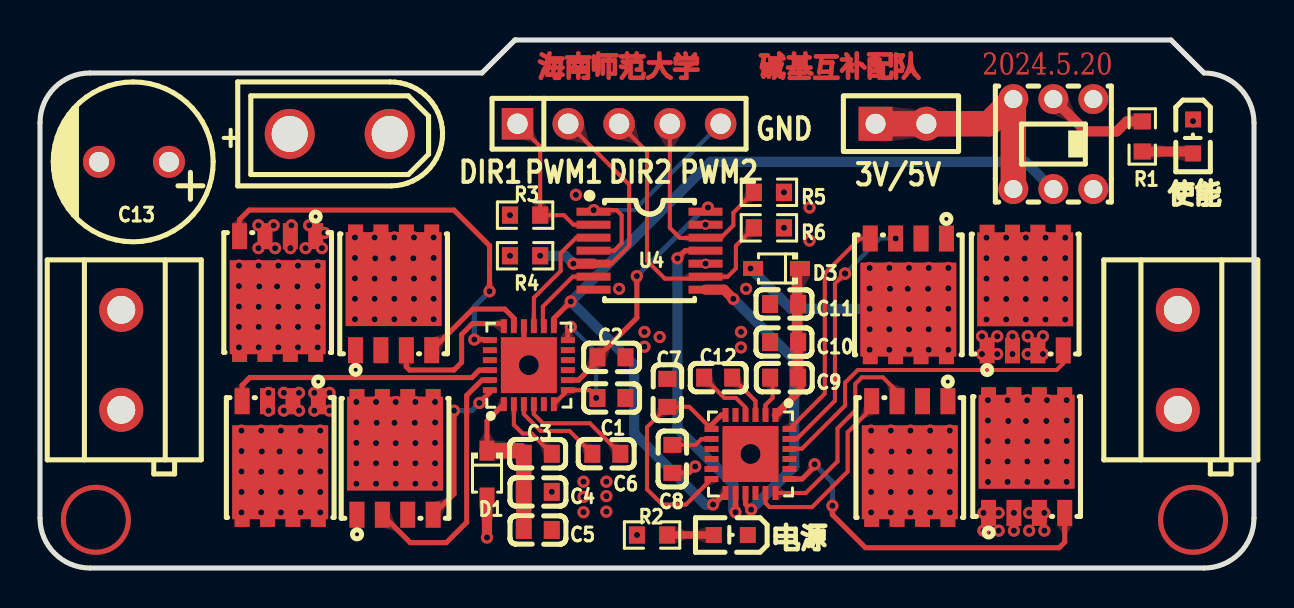
[diagram p3: board, top side]
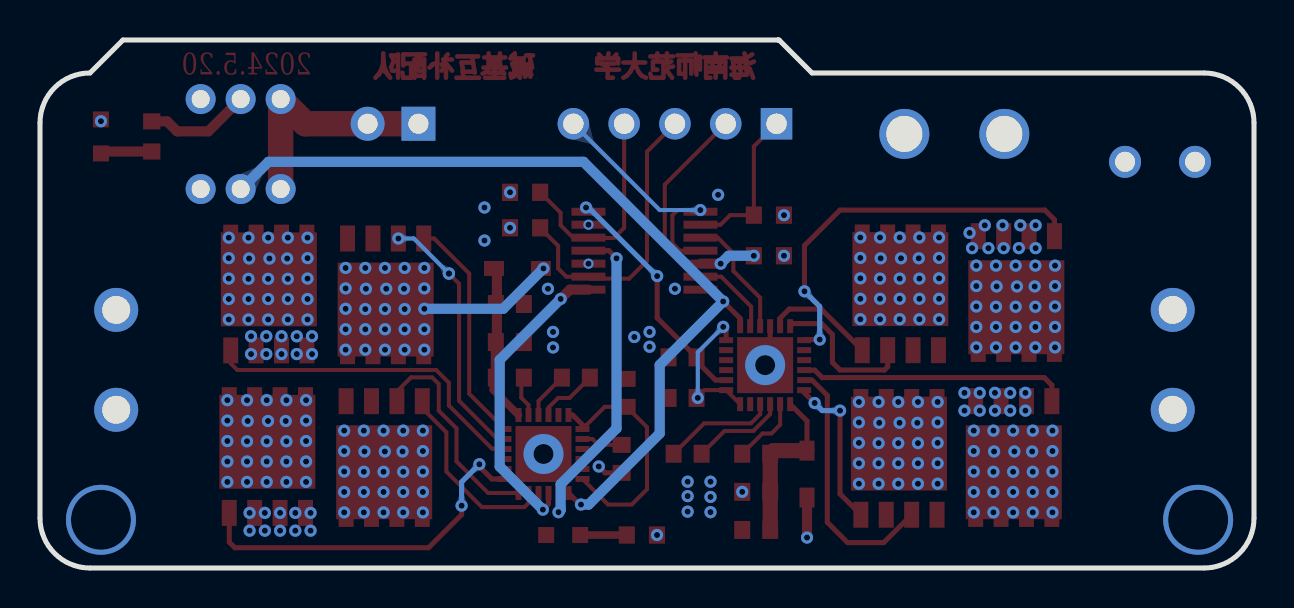
[diagram p4: board, bottom side, seen from below]

Outline 60.71 x 26.42 mm; copper layers: Top Layer, Bottom Layer. Coordinates in mm from the lower left corner of the outline.
Outline path: 0,22.27 0,2.5 arc(0.73,0.73) 2.5,0 58.21,0 arc(59.97,0.73) 60.71,2.5 60.71,22.27 arc(59.97,24.03) 58.21,24.77 56.56,26.42 23.75,26.42 22.1,24.77 2.5,24.77 arc(0.73,24.03) 0,22.27
Stack: Top Layer 0.035mm / Dielectric1 1.51mm FR4 er 4.5 / Bottom Layer 0.035mm

## Design rules (mm)
spacing copperThickness1oz (default): track to track 0.102, other pairs 0.152 to 0.3
spacing copperThickness2oz: track to track 0.203, other pairs 0.152 to 0.3
track width copperThickness1oz (default): min 0.127, default 0.254, max 2.54
track width copperThickness2oz: min 0.203, default 0.254, max 2.54
differential pair differentialPair (default): width min 0.127, default 0.254, max 2.54; gap min 0.152, default 0.152
via viaSize (default): diameter min 0.5, default 0.61, max 10; hole min 0.3, default 0.305, max 6.3

## Placement (name value [footprint] x y rotation side)
C1  105  [C0603]  28.58 8.51 180 top
C2  105  [C0603]  28.58 10.54 180 top
C3  105  [C0603]  24.89 5.72 0 top
C4  104  [C0603]  24.89 3.81 180 top
C5  106  [C0603]  24.89 1.91 180 top
C6  104  [C0603]  28.32 5.72 0 top
C7  105  [C0603]  31.37 8.76 270 top
C8  105  [C0603]  31.62 5.46 90 top
C9  105  [C0603]  37.21 9.53 180 top
C10  104  [C0603]  37.21 11.3 0 top
C11  106  [C0603]  37.21 13.21 0 top
C12  104  [C0603]  33.91 9.53 180 top
C13  220uF  [CAP-TH_BD8.0-P3.50-D0.6-FD]  4.7 20.32 180 top
CN1  -  [CONN-TH_XT30UPB-M]  14.99 21.72 180 top
CN2  KF301-5.0-2P  [CONN-TH_P5.00_KF301-5.0-2P]  4.06 10.41 270 top
CN3  KF301-5.0-2P  [CONN-TH_P5.00_KF301-5.0-2P]  56.9 10.41 270 top
D1  1N5819WS  [SOD-323_L1.8-W1.3-LS2.5-RD]  22.35 4.7 270 top
D3  1N5819WS  [SOD-323_L1.8-W1.3-LS2.5-RD]  36.83 14.99 180 top
H4  -  [HDR-TH_5P-P2.54-V-F]  28.96 22.23 0 top
H6  -  [HDR-TH_2P-P2.54-V-F]  43.05 22.23 0 top
LED2  供电  [LED0603-R-RD]  34.54 1.65 180 top
Q1  CSD17570Q5B  [PG-TSON-8_L5.0-W6.0-P1.27-BL-EP_BSC021N08NS5]  17.75 5.49 0 top
Q2  CSD17570Q5B  [PG-TSON-8_L5.0-W6.0-P1.27-BL-EP_BSC021N08NS5]  12.01 5.53 180 top
Q3  CSD17570Q5B  [PG-TSON-8_L5.0-W6.0-P1.27-BL-EP_BSC021N08NS5]  17.68 13.72 0 top
Q4  CSD17570Q5B  [PG-TSON-8_L5.0-W6.0-P1.27-BL-EP_BSC021N08NS5]  11.88 13.78 180 top
Q5  CSD17570Q5B  [PG-TSON-8_L5.0-W6.0-P1.27-BL-EP_BSC021N08NS5]  43.42 13.67 180 top
Q6  CSD17570Q5B  [PG-TSON-8_L5.0-W6.0-P1.27-BL-EP_BSC021N08NS5]  49.26 13.71 0 top
Q7  CSD17570Q5B  [PG-TSON-8_L5.0-W6.0-P1.27-BL-EP_BSC021N08NS5]  49.34 5.58 0 top
Q8  CSD17570Q5B  [PG-TSON-8_L5.0-W6.0-P1.27-BL-EP_BSC021N08NS5]  43.49 5.53 180 top
R1  1K  [R0603]  55.12 21.59 90 top
R2  4K7  [R0603]  30.61 1.65 180 top
R3  10K  [R0603]  24.26 17.65 180 top
R4  10K  [R0603]  24.26 15.62 180 top
R5  10K  [R0603]  36.45 18.8 180 top
R6  10K  [R0603]  36.45 17.02 180 top
SW1  使能开关  [SW-TH_6P-L5.8-W5.8-P2.00-LS4.5-BL]  50.67 21.21 0 top
U1  DRV8701ERGER  [VQFN-24_L4.0-W4.0-P0.50-BL-EP2.8]  24.45 10.15 0 top
U2  DRV8701ERGER  [VQFN-24_L4.0-W4.0-P0.50-BL-EP2.8]  35.53 5.7 180 top
U4  SN74HC125PWR  [TSSOP-14_L5.0-W4.4-P0.65-LS6.4-TL]  30.48 15.88 0 top
使能  使能  [LED0603-R-RD]  57.66 21.59 270 top

## Footprints (pads in the part's own frame, mm; a bottom-side part is the same pattern mirrored in y, then rotated)
C0603
  rect 0.8x0.9 smd: 1(-0.7,0) 2(0.7,0)
CAP-TH_BD8.0-P3.50-D0.6-FD
  round 1.6 hole 1: 1(-1.75,0) 2(1.75,0)
CONN-TH_P5.00_KF301-5.0-2P
  round 2.2 hole 1.399: 1(-2.499,0) 2(2.499,0)
CONN-TH_XT30UPB-M
  round 2.499 hole 1.801: 1(-2.499,0) 2(2.499,0)
HDR-TH_2P-P2.54-V-F
  rect 1.7x1.7 hole 1: 1(-1.27,0)
  round 1.7 hole 1: 2(1.27,0)
HDR-TH_5P-P2.54-V-F
  rect 1.575x1.575 hole 1.02: 1(-5.08,0)
  round 1.575 hole 1.02: 2(-2.54,0) 3(0,0) 4(2.54,0) 5(5.08,0)
LED0603-R-RD
  rect 0.8x0.8 smd: 1(0.851,0) 2(-0.851,0)
PG-TSON-8_L5.0-W6.0-P1.27-BL-EP_BSC021N08NS5
  rect 0.75x1.3 smd: 1(-1.905,-2.82) 2(-0.635,-2.82) 3(0.635,-2.82) 4(1.905,-2.82) 5(1.905,2.82) 6(0.635,2.82) 7(-0.635,2.82) 8(-1.905,2.82)
  rect 4.801x4.699 smd: 8(0,0.737)
R0603
  rect 0.806x0.864 smd: 1(-0.753,0) 2(0.753,0)
SOD-323_L1.8-W1.3-LS2.5-RD
  rect 1x0.75 smd: 1(-1.173,0) 2(1.173,0)
SW-TH_6P-L5.8-W5.8-P2.00-LS4.5-BL
  round 1.5 hole 0.9: 1(-2,-2.25) 2(0,-2.25) 3(2,-2.25) 4(-2,2.25) 5(0,2.25) 6(2,2.25)
TSSOP-14_L5.0-W4.4-P0.65-LS6.4-TL
  rect 1.7x0.4 smd: 1(-2.8,1.95) 2(-2.8,1.3) 3(-2.8,0.65) 4(-2.8,0) 5(-2.8,-0.65) 6(-2.8,-1.3) 7(-2.8,-1.95) 8(2.8,-1.95) 9(2.8,-1.3) 10(2.8,-0.65) 11(2.8,0) 12(2.8,0.65) 13(2.8,1.3) 14(2.8,1.95)
VQFN-24_L4.0-W4.0-P0.50-BL-EP2.8
  rect 0.3x0.7 smd: 1(-1.25,-1.95) 2(-0.75,-1.95) 3(-0.25,-1.95) 4(0.25,-1.95) 5(0.75,-1.95) 6(1.25,-1.95) 13(1.25,1.95) 14(0.75,1.95) 15(0.25,1.95) 16(-0.25,1.95) 17(-0.75,1.95) 18(-1.25,1.95)
  rect 0.7x0.3 smd: 7(1.95,-1.25) 8(1.95,-0.75) 9(1.95,-0.25) 10(1.95,0.25) 11(1.95,0.75) 12(1.95,1.25) 19(-1.95,1.25) 20(-1.95,0.75) 21(-1.95,0.25) 22(-1.95,-0.25) 23(-1.95,-0.75) 24(-1.95,-1.25)
  rect 2.8x2.8 smd: 25(0,0)

## Nets
+3V3: H6.1 H6.2 SW1.1 SW1.4
DVDD: C2.2 U1.8 U4.14
GND: C1.1 C2.1 C4.1 C5.1 C7.1 C8.1 C10.1 C11.1 C13.2 CN1.1 H4.5 LED2.2 Q2.1 Q2.2 Q2.3 Q4.1 Q4.2 Q4.3 Q6.1 Q6.2 Q6.3 Q7.1 Q7.2 Q7.3 R3.2 R4.2 R5.1 R6.1 U1.5 U1.16 U1.20 U1.21 U1.25 U2.5 U2.16 U2.20 U2.21 U2.25 U4.1 U4.4 U4.7 U4.10 U4.13 使能.2
$C1_2: C1.2 U1.6 U1.7 U1.12
$C3_1: C3.1 C4.2 C5.2 D1.1 U1.1
$C3_2: C3.2 U1.2
$C6_1: C6.1 U1.3
$C6_2: C6.2 U1.4
$C7_2: C7.2 U2.6 U2.7 U2.12
$C8_2: C8.2 U2.8
$C9_1: C9.1 C10.2 C11.2 D3.1 U2.1
$C9_2: C9.2 U2.2
$C12_1: C12.1 U2.3
$C12_2: C12.2 U2.4
$LED1_1: R1.1 使能.1
$LED2_1: LED2.1 R2.1
$R1_2: R1.2 SW1.5
EN1: H4.2 R4.1 U4.5
EN2: H4.4 R5.2 U4.12
ENA: U1.14 U4.6
ENB: U2.14 U4.11
GH1A: Q3.4 U1.17
GH1B: Q8.4 U2.17
GH2A: Q1.4 U1.24
GH2B: Q5.4 U2.24
GL1A: Q4.4 U1.19
GL1B: Q7.4 U2.19
GL2A: Q2.4 U1.22
GL2B: Q6.4 U2.22
NSLP: SW1.2 U1.13 U2.13
PH1: H4.1 R3.1 U4.2
PH2: H4.3 R6.2 U4.9
PHA: U1.15 U4.3
PHB: U2.15 U4.8
SH1A: CN2.1 Q3.1 Q3.2 Q3.3 Q4.5 Q4.6 Q4.7 Q4.8 U1.18
SH1B: CN3.2 Q7.5 Q7.6 Q7.7 Q7.8 Q8.1 Q8.2 Q8.3 U2.18
SH2A: CN2.2 Q1.1 Q1.2 Q1.3 Q2.5 Q2.6 Q2.7 Q2.8 U1.23
SH2B: CN3.1 Q5.1 Q5.2 Q5.3 Q6.5 Q6.6 Q6.7 Q6.8 U2.23
VH: C13.1 CN1.2 D1.2 D3.2 Q1.5 Q1.6 Q1.7 Q1.8 Q3.5 Q3.6 Q3.7 Q3.8 Q5.5 Q5.6 Q5.7 Q5.8 Q8.5 Q8.6 Q8.7 Q8.8 R2.2

Pads without a net: SW1 3 6; U1 9 10 11; U2 9 10 11

## Via types
v1: diameter 0.61, hole 0.305, Top Layer to Bottom Layer, 288 vias
v2: diameter 0.508, hole 0.305, Top Layer to Bottom Layer, 2 vias
v3: diameter 3.5, hole 3, Top Layer to Bottom Layer, 2 vias
v4: diameter 2, hole 1, Top Layer to Bottom Layer, 2 vias

## Routing (per net, layer and track width the routed paths; a pad name or vN(x,y) marks a point on that pad's centre or on a via; arc(x,y) is an arc through that point)
+3V3: length 11.9
  Top Layer w1.27: SW1.1 SW1.4 47.44,22.23 H6.2 H6.1
DVDD: length 11.9
  Top Layer w0.254: U1.8 26.93,9.4 27.88,10.35 C2.2 29.84,12.51 v1(29.84,14.61)
  Bottom Layer w0.254: v1(33.4,18.03) 33.27,18.03 v1(29.84,14.61)
GND: length 16.3
  Top Layer w0.203: U4.4 28.71,15.88 29.08,16.25 29.08,17.65 28.83,17.91 27.76,17.91 U4.1
  Top Layer w0.254: 24.2,10.4 v4(24.45,10.15) 24.2,10.4 ; 24.2,10.4 U1.16 ; 31.62,4.76 32.45,4.76 v1(32.77,5.08)
  Bottom Layer w0.203: 34.04,22.23 29.72,17.91 v1(27.69,17.91)
  vias: v1(10.92,17.15) v1(10.92,16) v1(11.43,8.76) v1(11.43,7.87) v1(11.68,17.15) v1(11.76,16) v1(12.19,8.76) v1(12.19,7.87) v1(12.52,16) v1(12.57,17.15) v1(12.95,8.76) v1(12.95,7.87) v1(13.28,16) v1(13.46,17.15) v1(13.72,8.76) v1(13.72,7.87) v1(14.1,16) v1(14.22,16.76) v1(14.48,8.76) v1(14.48,7.87) v1(23.5,17.65) v1(23.5,15.62) v1(25.59,3.81) v1(26.8,18.67) v1(27.18,4.32) v1(27.18,3.56) v1(27.18,2.79) v1(28.32,4.32) v1(28.32,3.6) v1(28.32,2.82) v1(28.96,13.97) v1(30.23,11.81) v1(30.23,11.07) v1(30.99,11.56) v1(35.05,11.81) v1(35.05,11.03) v1(35.31,13.97) v1(37.2,18.8) v1(37.2,17.02) v1(38.48,18.03) v1(38.48,16.38) v1(47.1,11.59) v1(47.1,10.7) v1(47.18,2.76) v1(47.18,1.87) v1(47.87,11.59) v1(47.87,10.7) v1(47.94,2.76) v1(47.94,1.87) v1(48.63,11.59) v1(48.63,10.7) v1(48.7,2.76) v1(48.7,1.87) v1(49.39,11.59) v1(49.39,10.7) v1(49.46,2.76) v1(49.46,1.87) v1(50.15,11.59) v1(50.15,10.7) v1(50.22,2.76) v1(50.22,1.87) v1(57.66,22.35) v2(33.28,17.18) v2(33.28,15.23) v3(2.79,2.41) v3(57.66,2.41) v4(35.53,5.7)
$C1_2: length 7.4
  Top Layer w0.203: U1.6 U1.7 27.48,8.9 C1.2
  Top Layer w0.254: 26.4,11.4 26.4,11.92 v1(26.54,12.07)
  Bottom Layer w0.203: v1(27.81,8.51) 27.81,10.8 v1(26.54,12.07)
$C3_1: length 8.4
  Top Layer w0.254: U1.1 22.35,7.36 D1.1
  Top Layer w0.762: D1.1 24.04,5.87 C3.1 C4.2 C5.2
$C3_2: length 3.5
  Top Layer w0.203: C3.2 24.58,6.73 24.13,6.73 23.7,7.17 U1.2
$C6_1: length 4.7
  Top Layer w0.203: C6.1 26.48,6.86 25.03,6.86 24.2,7.7 U1.3
$C6_2: length 5.6
  Top Layer w0.203: C6.2 27.5,7.24 25.15,7.24 24.7,7.7 U1.4
$C7_2: length 12.4
  Top Layer w0.203: U2.12 32.3,3.18 31.12,3.18 30.35,3.94 30.35,7.05 C7.2 32.47,8.06 U2.7
  Top Layer w0.254: U2.6 34.07,7.65 33.58,7.16 U2.7
$C8_2: length 2.3
  Top Layer w0.203: 31.37,6.16 32.78,6.16 33.08,6.45 U2.8
$C9_1: length 7.7
  Top Layer w0.381: C9.1 38.04,9.4 38.04,8.91 U2.1
  Top Layer w0.508: C9.1 C10.2 37.86,11.35 37.86,14.76
$C9_2: length 1.9
  Top Layer w0.203: U2.2 36.28,8.16 36.64,8.52 36.64,9.4
$C12_1: length 2.4
  Top Layer w0.203: C12.1 35.78,8.36 U2.3
$C12_2: length 3.1
  Top Layer w0.203: C12.2 34.22,8.51 34.8,8.51 35.28,8.03 U2.4
$LED1_1: length 2.6
  Top Layer w0.508: 使能.1 57.56,20.84 R1.1
$LED2_1: length 2.3
  Top Layer w0.381: R2.1 LED2.1
$R1_2: length 5.3
  Top Layer w0.508: R1.2 54.35,22.34 53.85,21.84 52.29,21.84 SW1.5
EN1: length 12.4
  Top Layer w0.203: 27.68,15.23 28.56,15.23 29.46,16.13 29.46,19.18 26.42,22.23
  Top Layer w0.508: 27.68,15.23 v1(26.67,15.23)
  Bottom Layer w0.508: v1(26.67,15.23) 26.27,15.62 v1(25.01,15.62)
EN2: length 10.9
  Top Layer w0.203: H4.4 31.5,17.02 32,16.51 33.27,16.51 33.28,16.53 34.05,16.53 34.67,17.15 34.67,17.77 R5.2
ENA: length 4.2
  Top Layer w0.203: U4.6 26.64,14.58 25.15,13.08 25.15,12.15 U1.14
ENB: length 16.4
  Top Layer w0.254: U2.14 v1(34.78,2.79) ; v1(31.88,15.49) 32.26,15.88 33.28,15.88
  Bottom Layer w0.508: v1(31.88,15.49) 31.88,6.98 34.67,4.19 34.67,2.9 v1(34.78,2.79)
GH1A: length 5.6
  Top Layer w0.254: 19.59,10.9 21.65,12.95 23.24,12.95 23.72,12.48 23.72,12.12 U1.17
GH1B: length 9.4
  Top Layer w0.203: Q8.4 41.59,7.99 40.39,6.79 40.39,4.83 38.61,3.05 36.48,3.05 36.28,3.25 U2.17
GH2A: length 7.9
  Top Layer w0.254: v1(21.97,8.26) 22.5,8.78 U1.24 ; v1(20.7,7.87) 20.7,3.71 Q1.4
  Bottom Layer w0.254: v1(20.7,7.87) 21.59,7.87 v1(21.97,8.26)
GH2B: length 11.5
  Top Layer w0.203: U2.24 39.24,8.72 39.24,14.73 41,16.48 Q5.4
GL1A: length 20.1
  Top Layer w0.254: v1(22.48,13.84) 22.48,16.13 20.7,17.91 10.46,17.91 9.98,17.43 Q4.4 ; v1(21.72,11.43) 22.47,11.43 22.5,11.4
  Bottom Layer w0.254: v1(21.72,11.43) 21.72,13.08 v1(22.48,13.84)
GL1B: length 18.5
  Top Layer w0.254: U2.19 38.11,4.45 38.74,5.08 ; 39.62,3.3 39.62,2.67 41.28,1.02 50.96,1.02 51.24,1.3 Q7.4
  Bottom Layer w0.254: v1(38.74,5.19) 39.62,4.3 v1(39.62,3.12)
GL2A: length 13.5
  Top Layer w0.254: Q2.4 10.11,9.14 10.49,9.53 21.59,9.53 21.97,9.9 U1.22
GL2B: length 16.8
  Top Layer w0.203: U2.22 37.49,5.97 38.1,5.97 40.26,8.13 40.26,9.27 40.89,9.91 50.84,9.91 51.17,10.24 Q6.4
NSLP: length 43.3
  Top Layer w0.254: v1(26.54,13.34) 25.7,12.49 U1.13 ; U2.13 33.7,3.18 v1(33.66,3.18)
  Bottom Layer w0.508: 50.64,18.96 49.28,20.32 33.53,20.32 v1(26.54,13.34) 29.72,10.16 29.72,6.73 33.27,3.18 v1(33.66,3.18)
PH1: length 7.9
  Top Layer w0.203: U4.2 26.68,17.18 26.2,17.65 R3.1 25.01,21.09 H4.1
PH2: length 14.9
  Top Layer w0.203: R6.2 34.8,16.12 34.8,14.99 34.39,14.58 33.28,14.58 33.18,14.48 31.24,14.48 30.35,15.37 30.35,20.83 H4.3
PHA: length 6.2
  Top Layer w0.203: U4.3 26.81,16.53 26.03,15.75 26.03,14.86 24.7,13.52 U1.15
PHB: length 15.1
  Top Layer w0.254: U2.15 35.28,3.2 v1(35.56,2.92)
  Top Layer w0.508: 33.28,13.93 34.21,13.93 34.54,13.59
  Bottom Layer w0.508: v1(34.67,13.46) 37.72,10.41 37.72,5.08 v1(35.56,2.92)
SH1A: length 7.6
  Top Layer w0.254: U1.18 23.07,12.23 21.62,12.23 21.08,11.68 21.08,10.29 20.7,9.91 18.48,9.91 18.32,10.07 18.32,10.9
  vias: v1(9.95,15.13) v1(9.95,14.11) v1(9.95,13.08) v1(9.95,12.06) v1(9.95,11.04) v1(10.93,15.13) v1(10.97,14.09) v1(10.93,13.07) v1(10.93,12.06) v1(10.93,11.04) v1(11.92,15.13) v1(11.85,14.09) v1(11.92,13.07) v1(11.92,12.06) v1(11.92,11.04) v1(12.9,15.13) v1(12.87,14.09) v1(12.9,13.07) v1(12.9,12.06) v1(12.9,11.04) v1(13.89,15.13) v1(13.89,14.11) v1(13.89,13.08) v1(13.89,12.06) v1(13.89,11.04)
SH1B: length 11
  Top Layer w0.203: U2.18 38.3,3.75 39.88,5.33 39.88,6.98 40.77,7.87 40.77,9.21 41.1,9.54 42.15,9.54 42.86,8.83 Q8.3
  vias: v1(47.4,8.4) v1(47.4,7.37) v1(47.4,6.35) v1(47.4,5.33) v1(47.4,4.31) v1(48.39,8.4) v1(48.42,7.36) v1(48.39,6.34) v1(48.39,5.33) v1(48.39,4.31) v1(49.31,7.36) v1(49.37,8.4) v1(49.37,6.34) v1(49.37,5.33) v1(49.37,4.31) v1(50.32,7.36) v1(50.35,8.4) v1(50.35,6.34) v1(50.35,5.33) v1(50.35,4.31) v1(51.34,8.4) v1(51.34,7.37) v1(51.34,6.35) v1(51.34,5.33) v1(51.34,4.31)
SH2A: length 13
  Top Layer w0.254: Q1.2 18.52,1.27 20.32,1.27 21.34,2.29 21.34,8.64 22.1,9.4 U1.23
  vias: v1(10.08,6.87) v1(10.08,5.85) v1(10.08,4.83) v1(10.08,3.81) v1(10.08,2.78) v1(11.06,6.87) v1(11.09,5.83) v1(11.06,4.82) v1(11.06,3.81) v1(11.06,2.78) v1(11.98,5.83) v1(12.05,6.87) v1(12.05,4.82) v1(12.05,3.81) v1(12.05,2.78) v1(13.03,6.87) v1(13,5.83) v1(13.03,4.82) v1(13.03,3.81) v1(13.03,2.78) v1(14.01,6.87) v1(14.01,5.85) v1(14.01,4.83) v1(14.01,3.81) v1(14.01,2.78)
SH2B: length 12.9
  Top Layer w0.203: v1(40.26,14.73) 39.75,14.22 39.75,8.37 37.84,6.45 U2.23
  Bottom Layer w0.203: v1(42.79,16.48) 42.01,16.48 v1(40.26,14.73)
  vias: v1(47.33,16.53) v1(47.33,15.5) v1(47.33,14.48) v1(47.33,13.46) v1(47.33,12.44) v1(48.31,16.53) v1(48.31,14.47) v1(48.31,13.46) v1(48.31,12.44) v1(48.34,15.48) v1(49.3,16.53) v1(49.23,15.48) v1(49.3,14.47) v1(49.3,13.46) v1(49.3,12.44) v1(50.28,16.53) v1(50.25,15.48) v1(50.28,14.47) v1(50.28,13.46) v1(50.28,12.44) v1(51.27,16.53) v1(51.27,15.5) v1(51.27,14.48) v1(51.27,13.46) v1(51.27,12.44)
VH: length 8.8
  Top Layer w0.508: D1.2 v1(22.35,1.52)
  Bottom Layer w0.508: v1(41.49,12.97) 37.55,12.97 v1(35.53,14.99)
  vias: v1(15.75,16.54) v1(15.75,15.51) v1(15.75,14.49) v1(15.75,13.47) v1(15.75,12.45) v1(15.82,8.31) v1(15.82,7.28) v1(15.82,6.26) v1(15.82,5.24) v1(15.82,4.22) v1(16.73,16.54) v1(16.73,14.48) v1(16.73,13.47) v1(16.73,12.45) v1(16.76,15.49) v1(16.8,8.31) v1(16.8,6.25) v1(16.8,5.24) v1(16.8,4.22) v1(16.84,7.26) v1(17.72,16.54) v1(17.65,15.49) v1(17.72,14.48) v1(17.72,13.47) v1(17.72,12.45) v1(17.72,7.26) v1(17.79,8.31) v1(17.79,6.25) v1(17.79,5.24) v1(17.79,4.22) v1(18.7,16.54) v1(18.67,15.49) v1(18.7,14.48) v1(18.7,13.47) v1(18.7,12.45) v1(18.77,8.31) v1(18.74,7.26) v1(18.77,6.25) v1(18.77,5.24) v1(18.77,4.22) v1(19.69,16.54) v1(19.69,15.51) v1(19.69,14.49) v1(19.69,13.47) v1(19.69,12.45) v1(19.76,8.31) v1(19.76,7.28) v1(19.76,6.26) v1(19.76,5.24) v1(19.76,4.22) v1(29.85,1.65) v1(41.49,15.01) v1(41.49,13.99) v1(41.49,11.94) v1(41.49,10.92) v1(41.56,6.87) v1(41.56,5.85) v1(41.56,4.83) v1(41.56,3.81) v1(41.56,2.78) v1(42.47,15.01) v1(42.5,13.97) v1(42.47,12.95) v1(42.47,11.94) v1(42.47,10.92) v1(42.54,6.87) v1(42.58,5.83) v1(42.54,4.82) v1(42.54,3.81) v1(42.54,2.78) v1(43.39,13.97) v1(43.46,15.01) v1(43.46,12.95) v1(43.46,11.94) v1(43.46,10.92) v1(43.53,6.87) v1(43.46,5.83) v1(43.53,4.82) v1(43.53,3.81) v1(43.53,2.78) v1(44.41,13.97) v1(44.44,15.01) v1(44.44,12.95) v1(44.44,11.94) v1(44.44,10.92) v1(44.51,6.87) v1(44.48,5.83) v1(44.51,4.82) v1(44.51,3.81) v1(44.51,2.78) v1(45.42,15.01) v1(45.42,13.99) v1(45.42,12.97) v1(45.42,11.94) v1(45.42,10.92) v1(45.5,6.87) v1(45.5,5.85) v1(45.5,4.83) v1(45.5,3.81) v1(45.5,2.78)

## Copper pours and planes (outline as drawn; the poured copper is in the pictures)
GND on Top Layer: -6.86,30.61 62.61,30.61 62.61,-5.46 -6.86,-5.46
GND on Bottom Layer: -1.65,27.94 61.09,27.94 61.09,-2.29 -1.65,-2.29
SH1A on Top Layer: 2.55,15.49 14.73,15.49 14.73,11.76 18.92,11.76 18.92,10.16 2.55,10.16
SH1A on Bottom Layer: 2.67,15.49 14.22,15.49 14.22,10.97 2.67,10.97
SH1B on Top Layer: 42.29,7.49 46.36,7.49 46.36,3.79 58.67,3.79 58.67,9.2 42.29,9.2
SH1B on Bottom Layer: 46.74,9.14 58.67,9.14 58.67,3.46 46.64,3.46 46.64,9.05
SH2A on Top Layer: 2.48,9.36 8.45,9.36 8.45,8.24 9.32,7.37 14.83,7.37 14.83,3.5 18.92,3.5 18.92,1.46 2.48,1.46
SH2A on Bottom Layer: 2.61,9.02 8.26,9.02 8.26,8.26 9.4,7.11 14.35,7.11 14.35,1.78 2.61,1.78
SH2B on Top Layer: 42.29,17.4 56.94,17.4 58.84,15.5 58.84,11.37 52.61,11.37 51.96,12.02 46.44,12.02 46.44,15.34 46.11,15.67 42.29,15.67
SH2B on Bottom Layer: 46.74,12.07 51.96,12.07 52.59,11.43 58.88,11.43 58.88,17.4 46.74,17.4
VH on Bottom Layer: 5.21,23.24 13.85,23.24 13.85,22.34 17.53,18.67 20.19,18.67 20.19,3.81 21.72,2.29 40.51,2.29 40.73,2.5 40.73,13.99 41.91,15.17 41.91,15.37 46.11,15.37 46.11,0.25 15.27,0.25 15.27,16.48 12.95,18.8 5.21,18.8

Small or netless copper shapes (teardrops, artwork), in the pictures only: 116 on Top Layer, 16 on Bottom Layer

## Text on the board
Top Layer: 海南师范大学 | 碱基互补配队 | 2024.5.20
Top Silkscreen Layer: + | DIR1 | PWM1 | DIR2 | PWM2 | GND | 3V/5V | 电源 | 使能
